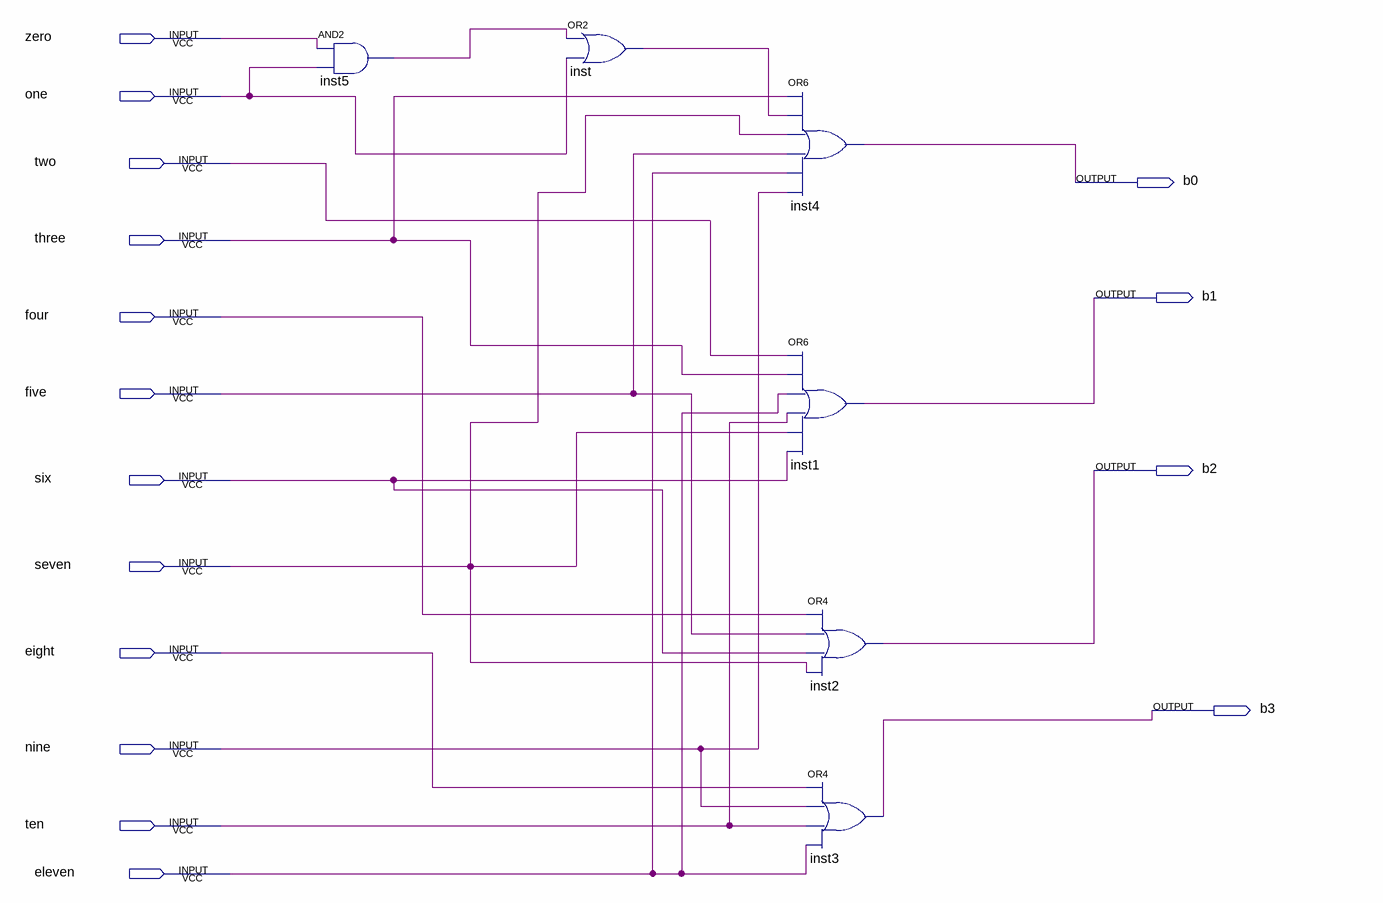
[diagram p0: schematic sheet]
// Quartus schematic lab3_1_1.bdf as structural Verilog: 6 symbols, 16 pins
module lab3_1_1 (
  input  zero,
  input  one,
  input  two,
  input  three,
  input  four,
  input  five,
  input  six,
  input  seven,
  input  eight,
  input  nine,
  input  ten,
  input  eleven,
  output b0,
  output b1,
  output b2,
  output b3
);

  wire inst5_out, inst_out;

  and inst5 (inst5_out, zero, one);
  or inst (inst_out, inst5_out, one);
  or inst4 (b0, three, inst_out, seven, five, eleven, nine);
  or inst1 (b1, two, three, eleven, ten, seven, six);
  or inst2 (b2, four, five, six, seven);
  or inst3 (b3, eight, nine, ten, eleven);
endmodule
